# EAGLE design riffle-MIN-O (EAGLE 6.5.0)
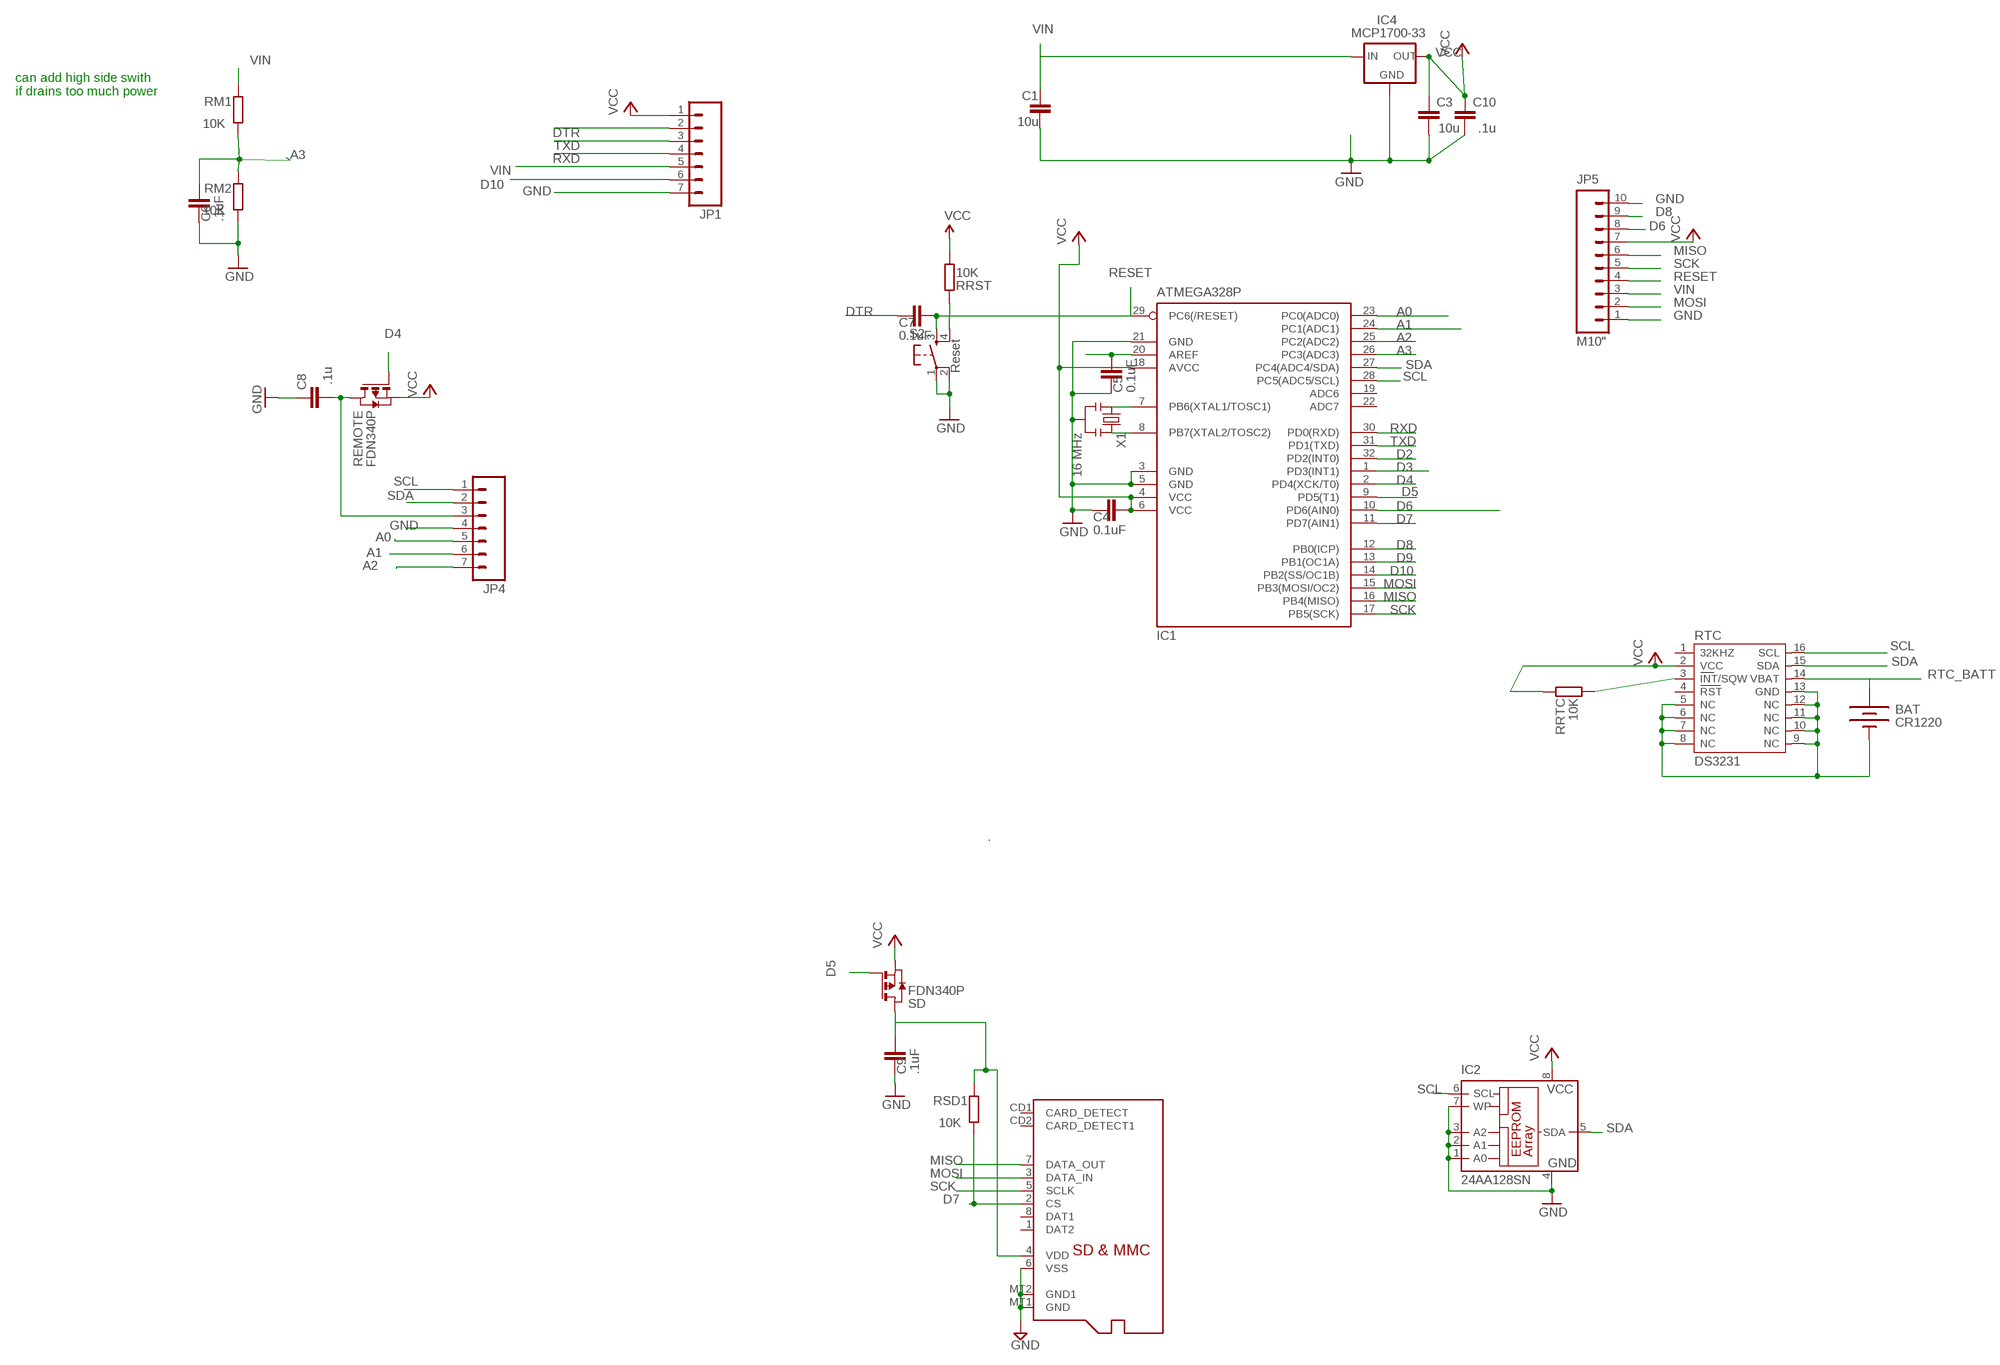
[diagram p0: schematic, sheet 1]

## Parts
BAT  CR1220  BATTERYBATTERY_12MM_SMT  [BATTCON_12MM_SMT]
C1  10u  C-EUC0805  [C0805]
C3  10u  C-EUC0805  [C0805]
C4  0.1uF  C-EUC0805  [C0805@1]
C5  0.1uF  C-EUC0805  [C0805@1]
C6  .1uF  C-EUC0805  [C0805@1]
C7  0.1uF  C-EUC0805  [C0805@1]
C8  .1u  C-EUC0805  [C0805]
C9  .1uF  C-EUC0805  [C0805@1]
C10  .1u  C-EUC0805  [C0805]
IC1  ATMEGA328P  MEGA8-AI  [TQFP32-08]
IC2  24AA128SN  [SO-08]
IC4  MCP1700-33  MCP1700SOT233  [SOT23]
JP1  M07  [1X07]
JP4  M07  [1X07]
JP5  M10"  [1X10]
MICROSD  MICROSD  [MICROSD]
REMOTE  FDN340P  PMOSSOT23  [SOT-23]
RM1  10K  R-EU_R0805  [R0805]
RM2  10K  R-EU_R0805  [R0805]
RRST  10K  R-EU_R0805  [R0805]
RRTC  10K  R-EU_R0805  [R0805]
RSD1  10K  R-EU_R0805  [R0805]
RTC  DS3231  [DS3231]
S2  Reset  TAC_SWITCHSMD  [TACTILE_SWITCH_SMD]
SD  FDN340P  PMOSSOT23  [SOT-23]
X1  16 MHz  RESONATORSMD  [RESONATOR-SMD]

## Nets
A0: IC1.23(PC0(ADC0)) JP4.5
A1: IC1.24(PC1(ADC1)) JP4.6
A2: IC1.25(PC2(ADC2)) JP4.7
A3: C6.2 IC1.26(PC3(ADC3)) RM1.1 RM2.2
AREF: C5.2 IC1.20(AREF)
D2: IC1.32(PD2(INT0))
D3: IC1.1(PD3(INT1))
D4: IC1.2(PD4(XCK/T0)) REMOTE.3(G)
D5: IC1.9(PD5(T1)) SD.3(G)
D6: IC1.10(PD6(AIN0)) JP5.8
D7: IC1.11(PD7(AIN1)) MICROSD.2(CS) RSD1.1
D8: IC1.12(PB0(ICP)) JP5.9
D9: IC1.13(PB1(OC1A))
D10: IC1.14(PB2(SS/OC1B)) JP1.6
DTR: C7.1 JP1.2
GND: BAT.P$1(-) C1.2 C3.2 C4.1 C5.1 C6.1 C8.1 C9.1 C10.2 IC1.3(GND) IC1.5(GND) IC1.21(GND) IC2.1(A0) IC2.2(A1) IC2.3(A2) IC2.4(GND) IC2.7(WP) IC4.1(GND) JP1.7 JP4.4 JP5.1 JP5.10 MICROSD.6(VSS) MICROSD.MT1(GND) MICROSD.MT2(GND1) RM2.1 RTC.5(NC) RTC.6(NC) RTC.7(NC) RTC.8(NC) RTC.9(NC) RTC.10(NC) RTC.11(NC) RTC.12(NC) RTC.13(GND) S2.1 S2.2 X1.2
MISO: IC1.16(PB4(MISO)) JP5.6 MICROSD.7(DATA_OUT)
MOSI: IC1.15(PB3(MOSI/OC2)) JP5.2 MICROSD.3(DATA_IN)
N$2: IC1.8(PB7(XTAL2/TOSC2)) X1.3
N$3: IC1.7(PB6(XTAL1/TOSC1)) X1.1
N$16: RRTC.1 RTC.3(INT/SQW)
RESET: C7.2 IC1.29(PC6(/RESET)) JP5.4 RRST.2 S2.3 S2.4
RTC_BATT: BAT.P$2(+) RTC.14(VBAT)
RXD: IC1.30(PD0(RXD)) JP1.4
SCK: IC1.17(PB5(SCK)) JP5.5 MICROSD.5(SCLK)
SCL: IC1.28(PC5(ADC5/SCL)) IC2.6(SCL) JP4.1 RTC.16(SCL)
SDA: IC1.27(PC4(ADC4/SDA)) IC2.5(SDA) JP4.2 RTC.15(SDA)
TXD: IC1.31(PD1(TXD)) JP1.3
VCC: C3.1 C4.2 C8.2 C10.1 IC1.4(VCC) IC1.6(VCC) IC1.18(AVCC) IC2.8(VCC) IC4.2(OUT) JP1.1 JP4.3 JP5.7 REMOTE.1(D) REMOTE.2(S) RRST.1 RRTC.2 RTC.2(VCC) SD.2(S)
VDD: C9.2 MICROSD.4(VDD) RSD1.2 SD.1(D)
VIN [power]: C1.1 IC4.3(IN) JP1.5 JP5.3 RM1.2
Unconnected: IC1.19(ADC6) IC1.22(ADC7) MICROSD.1(DAT2) MICROSD.8(DAT1) MICROSD.CD1(CARD_DETECT) MICROSD.CD2(CARD_DETECT1) RTC.1(32KHZ) RTC.4(RST)

## Notes on the sheet
- can add high side swith
  if drains too much power

## Library data of the parts
BAT = SparkFunNew:BATTERY: Battery Holders Various common sizes : AA, AAA, 20mm coin cell and 12mm coin cell.
C1 C3 C8 C10 = resistor:C-EU: CAPACITOR, European symbol
C4-C7 C9 = rcl:C-EU: CAPACITOR, European symbol
IC1 = atmel:MEGA8: MICROCONTROLLER 8 Kbytes FLASH, 1 kbytes SRAM, 512 bytes EEPROM, USART, 6-channel 10 bit ADC, 2-channel 8 bit ADC Pin compatible with Atmega48, ATMega88, ATMega168 Source: avr.lbr; MPN: ATMEGA8-16AU; OC_FARNELL: 9171371; OC_NEWARK: 73M8863
IC2 = microchip:24*: Serial EEPROM I2C; MF: MICROCHIP; MPN: 24AA128-I/SN; OC_FARNELL: unknown; OC_NEWARK: 92C6842
IC4 = adafruit:MCP1700: VOLTAGE REGULATOR
JP1 JP4 = SparkFun-Connectors:M07: Header 7 Standard 7-pin 0.1" header. Use with straight break away headers (SKU : PRT-00116), right angle break away headers (PRT-00553), swiss pins (PRT-00743), machine pins (PRT-00117), and female headers (PRT-00115). NOTES ON THE VARIANTS LOCK and LOCK_LONGPADS... This footprint was designed to help hold the alignment of a through-hole component (i.e. 7-pin header) while soldering it into place. You may notice that each hole has been shifted either up or down by 0.005 of an inch from it's more standard position (which is usually a perfectly straight line). This slight alteration caused the pins (the squares in the middle) to touch the edges of the holes. Because they are alternating, it causes a "brace" to hold the header in place. 0.005 has proven to be the perfect amount of "off-center" position when using our standard breakaway headers. Although looks a little odd when you look at the bare footprint, once you have a header in there, the alteration is very hard to notice. Also, if you push a header all the way into place, it is covered up entirely on the bottom side. This idea of altering the position of holes to aid alignment will be further integrated into the Sparkfun Library for other footprints. It can help hold any component with 3 or more connection pins.
JP5 = SparkFun-Connectors:M10: Header 10 Standard 10-pin 0.1" header. Use with straight break away headers (SKU : PRT-00116), right angle break away headers (PRT-00553), swiss pins (PRT-00743), machine pins (PRT-00117), and female headers (PRT-00115).
MICROSD = adafruit:MICROSD: Micro-SD / Transflash card holder with SPI pinout For the 3M # 2908-05WB-MG and/or 4UCON #19656 push-push type
REMOTE SD = zetex:PMOSSOT23: MOS FET
RM1 RM2 RRST RRTC RSD1 = rcl:R-EU_: RESISTOR, European symbol
RTC = _lh-library:DS3231
S2 = SparkFun:TAC_SWITCH: Momentary Switch Button commonly used for reset or general input. Spark Fun Electronics SKU : COM-00097
X1 = SparkFun:RESONATOR: Resonator Small SMD resonator. This is the itty bitty 10/20MHz resonators with built in caps. CSTCE10M0G55 and CSTCE20M0V53. Footprint has been reviewed closely but hasn't been tested yet.

## Net classes
0 default: width 0.203 mm, clearance 0.203 mm
1 power: width 0.381 mm, clearance 0.254 mm

## Board
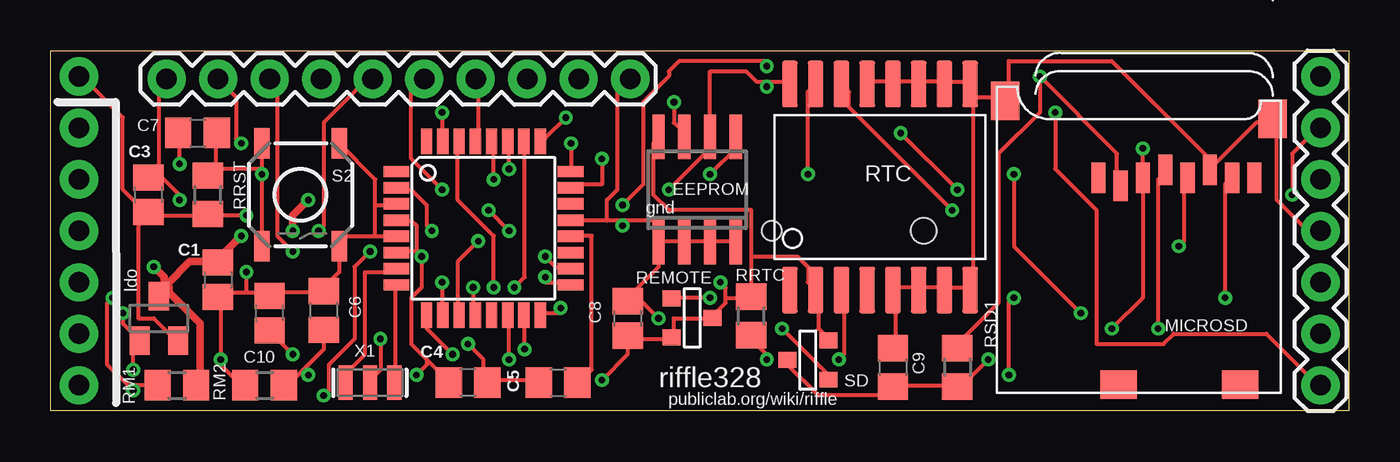
[diagram p1: board, top side]
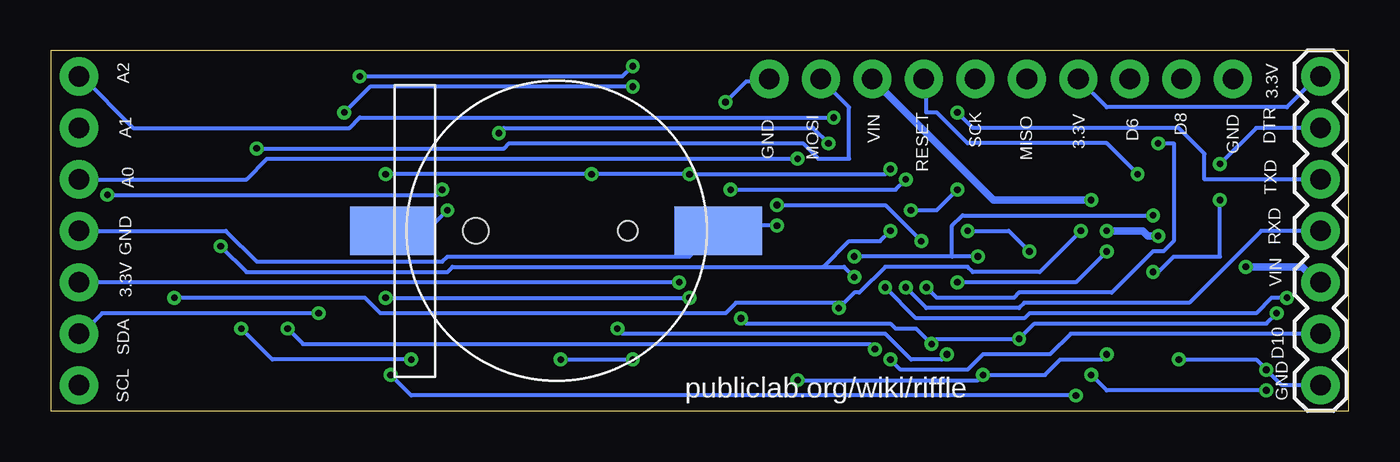
[diagram p2: board, bottom side, seen from below]

Size 64.01 x 17.78 mm. Coordinates in mm from the lower left corner, seen from the top.
Outline: 0,0 0,17.78 64.01,17.78 64.01,0 0,0
Copper layers (1*16): Top 0.0356mm / dielectric 1.5011mm / Bottom 0.0356mm
Design rules "LaenPCBOrder": minimum track width 6mil, minimum drill 13mil, track to track 6mil, track to pad 6mil, pad to pad 6mil, via to via 6mil, smd to smd 6mil, copper to edge 15mil, drill to drill 6mil, minimum pad ring 7mil, minimum via ring 7mil, stop-mask expansion 3mil, vias tented up to drill 0mil, thermal gap 10mil

### Footprints (pad centres in the part's own frame; a part is rotated, then mirrored left to right if it is on the bottom)
BATTCON_12MM_SMT = smd 2.4 x 4.3: P$1 0,11.96 | smd 2.4 x 4.2: P$2 0,-4.1 | hole 0.95: 0,7.5 | hole 1.25: 0,0
C0805 = smd 1.3 x 1.5: 1 -0.85,0; 2 0.85,0
C0805@1 = smd 1.3 x 1.5: 1 -0.95,0; 2 0.95,0
TQFP32-08 = smd 1.27 x 0.559: 1 -4.293,2.8; 2 -4.293,2; 3 -4.293,1.2; 4 -4.293,0.4; 5 -4.293,-0.4; 6 -4.293,-1.2; 7 -4.293,-2; 8 -4.293,-2.8; 17 4.293,-2.8; 18 4.293,-2; 19 4.293,-1.2; 20 4.293,-0.4; 21 4.293,0.4; 22 4.293,1.2; 23 4.293,2; 24 4.293,2.8 | smd 0.559 x 1.27: 9 -2.8,-4.293; 10 -2,-4.293; 11 -1.2,-4.293; 12 -0.4,-4.293; 13 0.4,-4.293; 14 1.2,-4.293; 15 2,-4.293; 16 2.8,-4.293; 25 2.8,4.293; 26 2,4.293; 27 1.2,4.293; 28 0.4,4.293; 29 -0.4,4.293; 30 -1.2,4.293; 31 -2,4.293; 32 -2.8,4.293
SO-08 = smd 0.6 x 2.2: 1 -1.905,-2.6; 2 -0.635,-2.6; 3 0.635,-2.6; 4 1.905,-2.6; 5 1.905,2.6; 6 0.635,2.6; 7 -0.635,2.6; 8 -1.905,2.6
SOT23 = smd 1 x 1.4: 1 -0.95,-1.1; 2 0.95,-1.1; 3 0,1.1
1X07 = drill 1.016 pad 1.88: 1 0,0; 2 2.54,0; 3 5.08,0; 4 7.62,0; 5 10.16,0; 6 12.7,0; 7 15.24,0
1X10 = drill 1.016 pad 1.88: 1 0,0; 2 2.54,0; 3 5.08,0; 4 7.62,0; 5 10.16,0; 6 12.7,0; 7 15.24,0; 8 17.78,0; 9 20.32,0; 10 22.86,0
MICROSD = smd 0.7 x 1.5: 1 9,-10.64; 2 7.9,-10.24; 3 6.8,-10.64; 4 5.7,-11.04; 5 4.6,-10.64; 6 3.5,-11.04; 7 2.4,-10.64; 8 1.3,-10.64 | smd 1.8 x 1.4: CD1 2,-0.44; CD2 8,-0.44 | smd 1.4 x 1.9: MT1 0.4,-13.54; MT2 13.6,-14.44
SOT-23 = smd 0.787 x 0.889: 1 0.025,-1.016; 2 -0.94,1.016; 3 0.991,1.016
R0805 = smd 1.3 x 1.5: 1 -0.95,0; 2 0.95,0
DS3231 = smd 0.762 x 2.286: 1 -4.445,-5.08; 2 -3.175,-5.08; 3 -1.905,-5.08; 4 -0.635,-5.08; 5 0.635,-5.08; 6 1.905,-5.08; 7 3.175,-5.08; 8 4.445,-5.08; 9 4.445,5.08; 10 3.175,5.08; 11 1.905,5.08; 12 0.635,5.08; 13 -0.635,5.08; 14 -1.905,5.08; 15 -3.175,5.08; 16 -4.445,5.08
TACTILE_SWITCH_SMD = smd 1.524 x 0.762: 1 -2.54,1.905; 2 2.54,1.905; 3 -2.54,-1.905; 4 2.54,-1.905
RESONATOR-SMD = smd 0.7 x 1.7: 1 -1.2,0; 2 0,0; 3 1.2,0

### Placement (x,y rotation side)
BAT  43.05,8.89 270 bottom
C1  8.25,6.48 270 top
C3  4.83,10.67 90 top
C4  20.57,1.4 180 top
C5  25.02,1.4 0 top
C6  13.46,4.95 270 top
C7  7.24,13.72 0 top
C8  28.45,4.57 270 top
C9  41.53,2.16 270 top
C10  10.79,4.83 90 top
IC1  21.34,9.02 0 top
IC2  31.88,10.92 0 top
IC4  5.33,4.57 0 top
JP1  1.4,16.51 270 bottom
JP4  62.61,1.27 90 top
JP5  28.58,16.38 180 top
MICROSD  60.66,0.86 180 top
REMOTE  31.62,4.57 90 top
RM1  6.22,1.27 0 top
RM2  10.54,1.27 0 top
RRST  7.75,10.67 90 top
RRTC  34.54,4.7 90 top
RSD1  44.7,2.16 270 top
RTC  40.89,11.05 0 top
S2  12.32,10.67 270 top
SD  37.34,2.54 270 top
X1  15.75,1.4 0 top

### Tracks (layer width: path | path; a pad name or v marks a point on that pad's centre or on a via)
A0  (via drill 0.33)
  Top 0.203: v27.18,12.45 27.18,11.18 25.65,11.18 IC1.23
  Bottom 0.203: v27.18,12.45 53.34,12.45 54.36,11.43 JP4.5
A1  (via drill 0.33)
  Top 0.203: v25.65,13.21 25.65,11.94 IC1.24 | v44.7,10.92 v41.91,13.72 | v61.21,10.67 61.21,12.7 62.48,13.97 JP4.6
  Bottom 0.203: v25.65,13.21 26.42,13.97 41.66,13.97 v41.91,13.72 | v44.7,10.92 44.96,10.67 v61.21,10.67
A2  (via drill 0.33)
  Top 0.203: v25.4,14.48 24.38,13.46 IC1.25
  Bottom 0.203: v25.4,14.48 48.77,14.48 49.28,13.97 59.94,13.97 62.48,16.51 JP4.7
A3  (via drill 0.33)
  Top 0.203: 12.45,2.03 13.46,3.05 C6.2 | 12.45,2.03 11.68,1.27 RM2.2 | v22.86,6.1 23.37,6.6 23.37,13.21 IC1.26 | v3.05,5.59 2.79,5.33 2.79,2.29 3.81,1.27 4.06,1.27 | RM1.1 4.06,1.27 | v12.7,1.78 12.45,2.03 | 4.06,1.27 v4.06,1.02
  Bottom 0.203: v22.86,6.1 21.34,4.57 16,4.57 15.75,4.83 4.57,4.83 3.81,5.59 v3.05,5.59 | v12.7,1.78 11.94,1.02 v4.06,1.02
AREF
  Top 0.203: IC1.20 25.65,8.64 26.67,8.64 26.67,2.03 26.16,1.52 C5.2
D4  (via drill 0.33)
  Top 0.203: v32.51,5.59 30.73,5.59 REMOTE.3 | v47.5,5.59 47.24,5.33 v47.24,1.78 | v13.46,0.76 13.72,1.02 13.72,2.29 14.99,3.56 14.99,7.11 v15.75,7.87 | v18.8,8.89 18.54,9.14 18.54,10.16 17.78,10.92 17.27,10.92 IC1.2
  Bottom 0.203: v47.5,5.59 v32.51,5.59 | v47.24,1.78 46.23,0.76 v13.46,0.76 | v15.75,7.87 16.76,8.89 v18.8,8.89
D5  (via drill 0.33)
  Top 0.203: v36.07,4.06 38.35,1.78 SD.3 | v19.81,2.79 18.54,4.06 18.54,4.57 IC1.9
  Bottom 0.203: v36.07,4.06 35.81,3.81 22.86,3.81 21.59,2.54 20.07,2.54 v19.81,2.79
D6  (via drill 0.33)
  Top 0.203: v19.3,6.35 19.3,4.83 IC1.10 | v11.94,7.87 11.18,8.64 11.18,16 JP5.8
  Bottom 0.203: v19.3,6.35 13.46,6.35 v11.94,7.87
D7  (via drill 0.33)
  Top 0.203: v21.08,8.38 20.07,7.37 20.07,4.83 IC1.11 | v28.19,10.16 29.21,11.18 29.21,15.24 30.48,16.51 30.48,16.76 30.99,17.27 35.31,17.27 v35.31,17.02 | MICROSD.2 52.58,11.18 52.58,12.7 v48.77,16.51 48.77,14.73 46.74,12.7 46.74,5.33 44.7,3.3 RSD1.1
  Bottom 0.203: v21.08,8.38 22.86,10.16 v28.19,10.16 | v35.31,17.02 35.81,16.51 v48.77,16.51
D8  (via drill 0.33)
  Top 0.203: v20.83,6.1 20.83,4.83 IC1.12 | v9.4,13.21 9.14,13.46 9.14,15.49 JP5.9
  Bottom 0.203: v20.83,6.1 20.32,5.59 16.51,5.59 16.26,5.84 11.68,5.84 9.65,7.87 9.14,7.87 8.64,8.38 8.64,13.21 v9.4,13.21
D10  (via drill 0.33)
  Top 0.203: v22.61,2.54 22.61,4.57 IC1.14
  Bottom 0.203: v22.61,2.54 22.1,2.03 18.8,2.03 18.03,2.79 14.73,2.79 13.72,3.81 JP1.6
DTR  (via drill 0.33)
  Top 0.203: v6.35,12.19 6.35,13.72 C7.1
  Bottom 0.203: v6.35,12.19 4.57,13.97 JP1.2
GND  (via drill 0.33)
  Top 0.203: 5.08,11.94 5.33,12.19 5.33,16 JP5.10 | 5.08,11.94 4.83,11.68 C3.2 5.08,11.94 | v4.06,2.03 4.06,3.05 4.32,3.3 IC4.1 4.32,3.56 3.56,4.32 v3.56,4.83 | RM2.1 9.4,1.27 8.38,2.29 v8.38,2.54 8.38,5.59 C1.2 8.38,5.84 9.65,5.84 | 9.65,5.84 10.67,5.84 C10.2 10.92,5.84 13.46,5.84 C6.1 13.46,6.1 14.22,6.86 S2.2 14.22,8.64 16,8.64 | 16,8.64 17.02,8.64 IC1.5 | 16,10.16 17.02,10.16 IC1.3 | 16,8.64 16,10.16 | S2.1 16,11.43 16,10.16 | 5.08,11.94 6.35,10.67 v6.35,10.41 | 9.65,5.84 v9.65,6.86 | C5.1 23.88,1.52 21.59,1.52 C4.1 21.34,1.52 21.34,2.54 v20.57,3.3 | v16.26,3.56 16.26,2.03 15.75,1.52 X1.2 | v30.73,15.24 30.73,14.22 31.24,13.72 IC2.7 | 28.19,9.4 29.97,9.4 29.97,8.38 | 28.19,9.4 27.43,9.4 | 27.43,9.4 25.65,9.4 IC1.21 | 28.7,5.84 29.97,7.11 IC2.1 29.97,8.38 | 28.7,5.84 28.45,5.59 C8.1 28.7,5.84 | 29.97,8.38 31.24,8.38 | 31.24,8.38 32.51,8.38 | 31.24,8.38 IC2.2 | 32.51,8.38 33.78,8.38 IC2.4 | 32.51,8.38 IC2.3 | 28.19,9.4 v28.19,9.14 | JP5.1 27.94,15.75 27.94,10.92 27.43,10.41 27.43,9.4 | 28.7,5.84 v29.97,4.57 | 57.4,12.19 57.4,11.94 MICROSD.6 57.4,12.19 | 57.4,12.19 59.44,14.22 60.2,14.22 MICROSD.MT1 60.45,14.22 60.45,10.41 61.98,8.89 JP4.4 | C9.1 41.66,3.3 41.66,5.84 RTC.5 41.66,6.1 42.67,6.1 RTC.6 42.93,6.1 43.94,6.1 RTC.7 44.2,6.1 45.21,6.1 RTC.8 45.47,6.1 45.47,15.49 | 45.47,15.49 46.99,15.49 MICROSD.MT2 47.24,15.49 47.24,17.27 52.32,17.27 57.4,12.19 | 45.47,15.49 45.47,16 RTC.9 | RTC.13 40.39,16.26 41.4,16.26 RTC.12 41.66,16.26 42.67,16.26 RTC.11 42.93,16.26 43.94,16.26 RTC.10 44.2,16.26 45.21,16.26 RTC.9 | 45.47,15.49 RTC.9
  Bottom 0.203: JP1.7 3.3,1.27 v4.06,2.03 4.57,2.54 v8.38,2.54 | v6.35,10.41 6.35,7.62 8.64,7.62 9.4,6.86 v9.65,6.86 | v30.73,15.24 29.72,16.26 28.7,16.26 JP5.1 | v28.19,9.14 30.73,9.14 30.99,8.89 BAT.P$1 31.24,8.89 32.51,7.62 44.45,7.62 44.7,7.37 53.85,7.37 55.37,8.89 JP4.4 | v29.97,4.57 29.72,4.32 22.61,4.32 22.35,4.06 21.34,4.06 v20.57,3.3 20.32,3.56 v16.26,3.56 15.49,4.32 4.06,4.32 v3.56,4.83
MISO  (via drill 0.33)
  Top 0.203: v25.15,5.08 25.15,4.83 24.38,4.83 IC1.16 | v13.21,8.89 13.46,9.14 13.46,14.22 15.75,16.51 JP5.6 | v57.91,5.59 57.91,11.18 58.17,11.43 MICROSD.7
  Bottom 0.203: 24.89,5.33 24.38,5.84 24.13,5.84 22.86,7.11 18.8,7.11 18.54,6.86 15.24,6.86 v13.21,8.89 | 24.89,5.33 v25.15,5.08 | v57.91,5.59 48.51,5.59 47.75,4.83 30.73,4.83 30.23,5.33 24.89,5.33
MOSI  (via drill 0.33)
  Top 0.203: v23.37,3.05 23.37,4.57 IC1.15 | v52.32,4.06 53.85,5.59 53.85,11.43 MICROSD.3 53.85,11.68 v53.85,12.95
  Bottom 0.203: v23.37,3.05 23.62,3.3 51.56,3.3 v52.32,4.06 | JP5.2 24.64,14.99 24.64,12.45 26.16,12.45 26.92,13.21 41.4,13.21 41.66,12.95 v53.85,12.95
N$2
  Top 0.203: IC1.8 17.02,6.1 17.02,1.52 X1.3
N$3
  Top 0.203: IC1.7 17.02,6.86 15.49,6.86 15.49,2.79 14.73,2.03 14.73,1.52 X1.1
N$16  (via drill 0.33)
  Top 0.203: v35.31,2.54 35.31,2.79 34.54,3.56 RRTC.1 | v38.86,2.54 39.12,2.79 39.12,5.84 RTC.3
  Bottom 0.203: v38.86,2.54 v35.31,2.54
RESET  (via drill 0.33)
  Top 0.203: IC1.29 21.08,13.46 21.08,16.26 JP5.4 | 8.13,11.94 7.87,11.68 RRST.2 8.13,11.94 | 8.13,11.94 8.13,13.72 C7.2 | S2.3 10.41,11.94 | 10.41,11.94 v10.41,11.68 S2.4 | 10.41,11.94 8.13,11.94
  Bottom 0.203: v10.41,11.68 11.94,13.21 18.8,13.21 20.32,14.73 20.83,14.73 20.83,16.26 JP5.4
RTC_BATT  (via drill 0.33)
  Top 0.203: RTC.14 39.37,15.75 39.37,14.99 v44.45,9.91
  Bottom 0.203: v44.45,9.91 45.47,8.89 BAT.P$2
RXD  (via drill 0.33)
  Top 0.203: v21.84,6.1 21.84,8.64 20.07,10.41 20.07,13.21 IC1.30
  Bottom 0.203: v21.84,6.1 20.83,5.08 16.26,5.08 16,5.33 7.87,5.33 4.32,8.89 JP1.4
SCK  (via drill 0.33)
  Top 0.203: v24.38,6.6 24.38,6.35 25.4,6.35 IC1.17 | v55.63,8.13 55.88,8.38 55.88,11.43 MICROSD.5 | JP5.5 17.78,15.75 17.78,12.45 v19.3,10.92 | v22.61,8.89 v21.59,9.91
  Bottom 0.203: v24.38,6.6 24.89,7.11 25.91,7.11 | 25.91,7.11 44.2,7.11 44.45,6.86 54.36,6.86 v55.63,8.13 | v19.3,10.92 20.32,9.91 v21.59,9.91 | v22.61,8.89 23.11,8.38 24.64,8.38 25.91,7.11
SCL  (via drill 0.33)
  Top 0.203: v21.84,11.43 21.84,13.21 IC1.28 | v30.48,10.92 32.51,12.95 IC2.6 32.51,16.76 34.29,16.76 34.8,16.26 35.31,16.26 | 35.31,16.26 36.32,16.26 RTC.16 | v49.53,14.73 49.53,11.94 51.56,9.91 51.56,3.3 54.86,3.3 55.37,3.81 59.94,3.81 62.48,1.27 JP4.1 | 35.31,16.26 v35.31,16
  Bottom 0.203: v21.84,11.43 22.35,10.92 v30.48,10.92 | v49.53,14.73 48.26,16 v35.31,16
SDA  (via drill 0.33)
  Top 0.203: v22.61,11.94 22.61,13.21 IC1.27 | v32.51,11.68 33.78,12.95 IC2.5 | RTC.15 37.34,15.75 v37.34,11.68 | v50.8,4.83 47.5,8.13 v47.5,11.68
  Bottom 0.203: v22.61,11.94 22.86,11.68 v32.51,11.68 v37.34,11.68 v47.5,11.68 | v50.8,4.83 61.47,4.83 62.48,3.81 JP4.2
TXD  (via drill 0.33)
  Top 0.203: v19.3,14.73 19.3,13.46 IC1.31
  Bottom 0.203: v19.3,14.73 18.54,13.97 8.38,13.97 7.11,12.7 7.11,11.43 JP1.3
VCC  (via drill 0.33)
  Top 0.203: 4.83,9.65 4.32,9.14 4.32,4.57 5.08,4.57 6.1,3.56 IC4.2 | 4.83,9.65 7.62,9.65 RRST.1 7.87,9.65 v9.65,9.65 | 4.83,9.65 3.56,10.92 3.56,14.48 1.52,16.51 JP1.1 | 4.83,9.65 C3.1 | 18.03,7.87 17.27,7.87 IC1.6 | 18.03,7.87 18.03,9.14 17.78,9.4 17.27,9.4 IC1.4 | v24.38,7.62 24.89,7.11 25.4,7.11 IC1.18 | 18.03,7.87 v18.29,7.62 18.29,6.1 17.78,5.59 17.78,3.3 18.54,2.54 | 18.54,2.54 19.56,1.52 C4.2 | v11.94,2.79 10.92,3.81 C10.1 | v18.03,1.78 18.54,2.29 18.54,2.54 | SD.2 38.35,3.56 37.85,4.06 37.85,5.84 RTC.2 37.34,6.35 37.34,7.11 36.83,7.62 34.54,7.62 | 28.45,3.56 30.48,3.56 REMOTE.2 30.73,3.81 30.73,4.57 32.51,4.57 REMOTE.1 32.77,4.83 33.27,5.33 33.27,5.59 | 33.27,5.59 34.54,5.59 RRTC.2 34.54,7.62 | 34.54,7.62 34.54,9.91 30.48,9.91 29.72,10.67 29.72,13.21 29.97,13.46 IC2.8 | v33.02,6.35 33.27,6.1 33.27,5.59 | v27.18,1.52 28.45,2.79 28.45,3.56 | 28.45,3.56 C8.2
  Bottom 0.203: JP5.7 11.94,14.99 3.05,14.99 1.52,16.51 JP1.1 | v18.29,7.62 19.56,7.62 | 19.56,7.62 v24.38,7.62 | v11.94,2.79 12.19,2.54 14.22,2.54 14.99,1.78 v18.03,1.78 18.29,1.52 v27.18,1.52 | v33.02,6.35 JP4.3 | v9.65,9.65 19.05,9.65 19.56,9.14 19.56,7.62
VDD  (via drill 0.33)
  Top 0.203: SD.1 36.32,2.29 37.85,0.76 41.4,0.76 41.4,1.02 C9.2 41.66,1.27 44.7,1.27 RSD1.2 44.7,1.02 v46.23,2.54 | v54.61,4.06 54.61,11.43 54.86,11.68 MICROSD.4
  Bottom 0.203: v54.61,4.06 53.09,2.54 v46.23,2.54
VIN  (via drill 0.33)
  Top 0.381: 5.71,6.22 6.86,7.37 8.13,7.37 C1.1 8.38,7.37 8.38,7.62 v9.4,8.64 | 5.71,6.22 5.33,5.84 IC4.3 5.59,6.35 5.59,6.6 v5.08,7.11 | RM1.2 7.37,1.27 7.37,4.32 5.84,5.84 5.84,6.1 5.71,6.22 | v12.7,10.41 11.94,9.65 v11.94,8.89
  Bottom 0.381: v5.08,7.11 2.29,7.11 1.52,6.35 JP1.5 | JP5.3 17.53,10.41 v12.7,10.41 | v11.94,8.89 10.16,8.89 9.91,8.64 v9.4,8.64

### Text on the board
tPlace: EEPROM | gnd | ldo | riffle328 | publiclab.org/wiki/riffle
bPlace: A2 | 3.3V | GND | D8 | 3.3V | MISO | SCK | RESET | VIN | MOSI | A1 | D6 | GND | DTR | A0 | TXD | GND | RXD | 3.3V | VIN | SDA | D10 | publiclab.org/wiki/riffle | SCL | GND